# EAGLE design PhotonThingyStick (EAGLE 7.4.0)
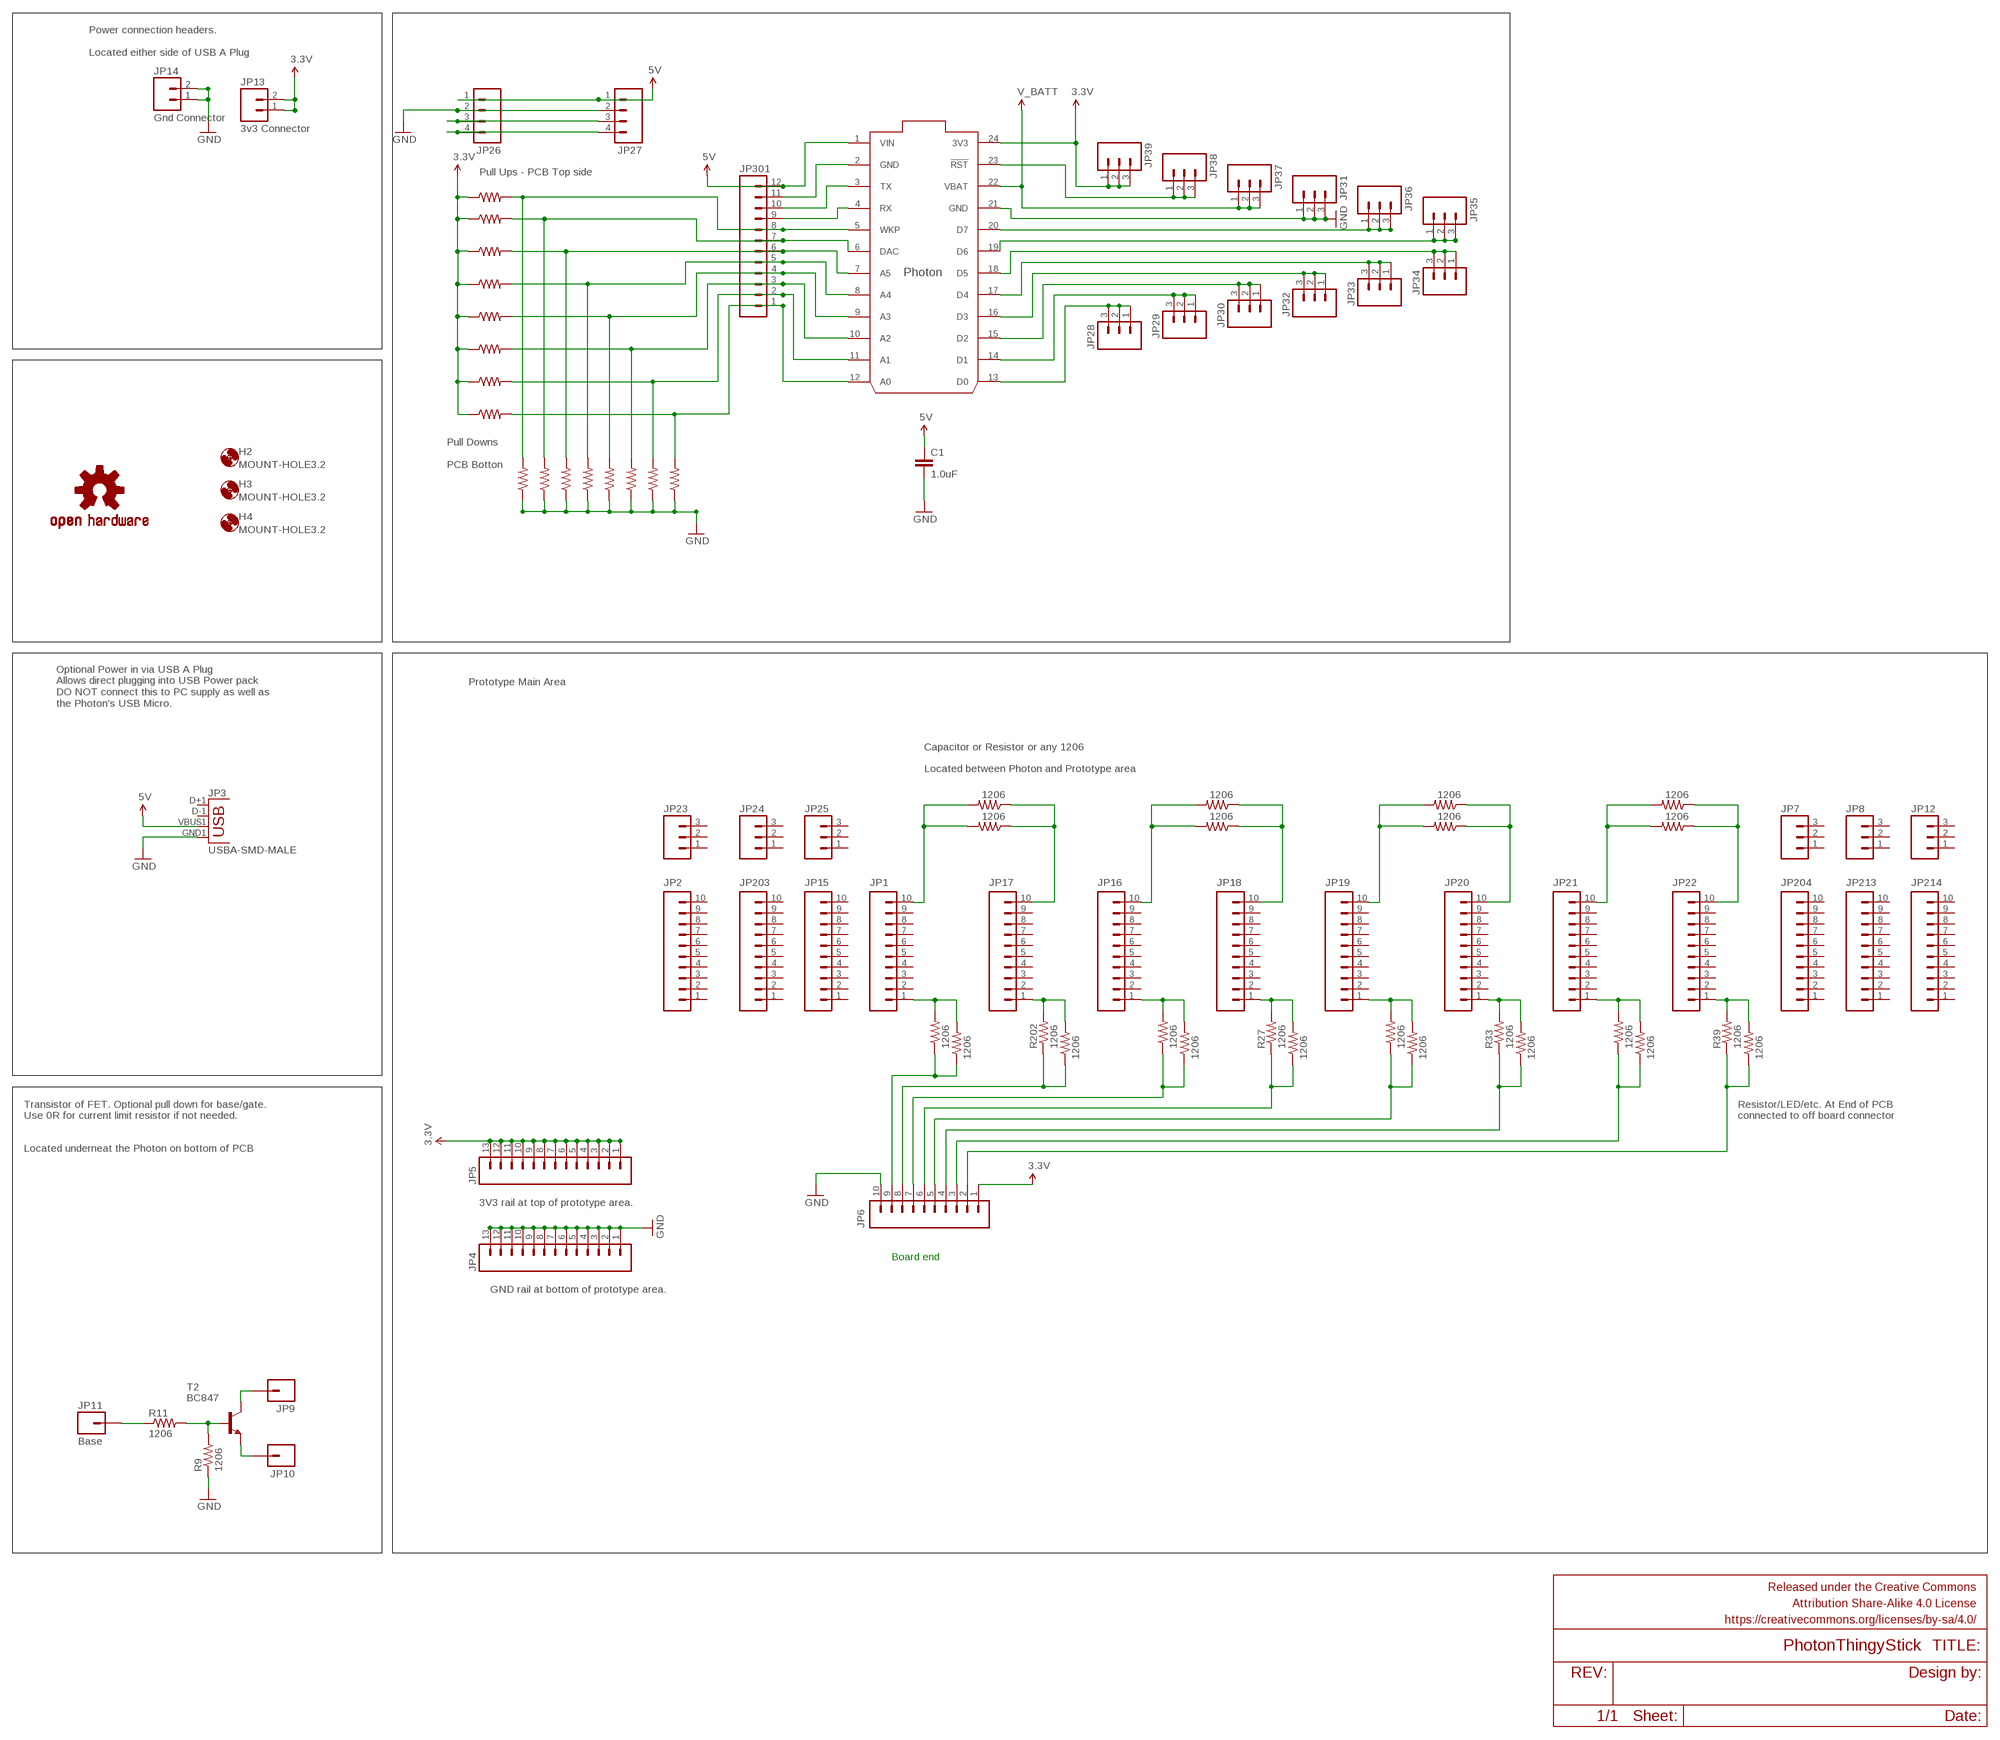
[diagram p0: schematic, sheet 1]

## Parts
C1  1.0uF  1.0UF-25V-+80/-20(0805)"  [0805-CAP]
FRAME1  FRAME-LEDGER  [CREATIVE_COMMONS]
H2  MOUNT-HOLE3.2  [3,2]
H3  MOUNT-HOLE3.2  [3,2]
H4  MOUNT-HOLE3.2  [3,2]
IC1  PHOTON_WITH_HEADERS  [PHOTON]
JP1  M10NO_SILK_PTH_FEMALE  [1X10_NO_SILK]
JP2  M10NO_SILK_PTH_FEMALE  [1X10_NO_SILK]
JP3  USBA-SMD-MALE  [USB-A-SMT-MALE]
JP4  M13  [1X13]
JP5  M13  [1X13]
JP6  M10NO_SILK_PTH_FEMALE  [1X10_NO_SILK]
JP7  M031X03_NO_SILK  [1X03_NO_SILK]
JP8  M031X03_NO_SILK  [1X03_NO_SILK]
JP9  M01PTH  [1X01]
JP10  M01PTH  [1X01]
JP11  Base  M01PTH  [1X01]
JP12  M031X03_NO_SILK  [1X03_NO_SILK]
JP13  3v3 Connector  M02PTH  [1X02]
JP14  Gnd Connector  M02PTH  [1X02]
JP15  M10NO_SILK_PTH_FEMALE  [1X10_NO_SILK]
JP16  M10NO_SILK_PTH_FEMALE  [1X10_NO_SILK]
JP17  M10NO_SILK_PTH_FEMALE  [1X10_NO_SILK]
JP18  M10NO_SILK_PTH_FEMALE  [1X10_NO_SILK]
JP19  M10NO_SILK_PTH_FEMALE  [1X10_NO_SILK]
JP20  M10NO_SILK_PTH_FEMALE  [1X10_NO_SILK]
JP21  M10NO_SILK_PTH_FEMALE  [1X10_NO_SILK]
JP22  M10NO_SILK_PTH_FEMALE  [1X10_NO_SILK]
JP23  M031X03_NO_SILK  [1X03_NO_SILK]
JP24  M031X03_NO_SILK  [1X03_NO_SILK]
JP25  M031X03_NO_SILK  [1X03_NO_SILK]
JP26  M041X04_NO_SILK  [1X04_NO_SILK]
JP27  M041X04_NO_SILK  [1X04_NO_SILK]
JP28  M03PTH  [1X03]
JP29  M03PTH  [1X03]
JP30  M03PTH  [1X03]
JP31  M03PTH  [1X03]
JP32  M03PTH  [1X03]
JP33  M03PTH  [1X03]
JP34  M03PTH  [1X03]
JP35  M03PTH  [1X03]
JP36  M03PTH  [1X03]
JP37  M03PTH  [1X03]
JP38  M03PTH  [1X03]
JP39  M03PTH  [1X03]
JP203  M10NO_SILK_PTH_FEMALE  [1X10_NO_SILK]
JP204  M10NO_SILK_PTH_FEMALE  [1X10_NO_SILK]
JP213  M10NO_SILK_PTH_FEMALE  [1X10_NO_SILK]
JP214  M10NO_SILK_PTH_FEMALE  [1X10_NO_SILK]
JP301  M12PTH  [1X12]
LOGO1  OSHW-LOGOM  [OSHW-LOGO-M]
R1  1206  RESISTOR1206  [1206]
R2  1206  RESISTOR1206  [1206]
R3  1206  RESISTOR1206  [1206]
R4  1206  RESISTOR1206  [1206]
R5  1206  RESISTOR1206  [1206]
R6  1206  RESISTOR1206  [1206]
R7  1206  RESISTOR1206  [1206]
R8  1206  RESISTOR1206  [1206]
R9  1206  RESISTOR1206  [1206]
R10  1206  RESISTOR1206  [1206]
R11  1206  RESISTOR1206  [1206]
R12  1206  RESISTOR1206  [1206]
R13  1206  RESISTOR1206  [1206]
R14  1206  RESISTOR1206  [1206]
R19  1206  RESISTOR1206  [1206]
R20  1206  RESISTOR1206  [1206]
R21  1206  RESISTOR1206  [1206]
R22  1206  RESISTOR1206  [1206]
R23  1206  RESISTOR1206  [1206]
R24  1206  RESISTOR1206  [1206]
R25  1206  RESISTOR1206  [1206]
R26  1206  RESISTOR1206  [1206]
R27  1206  RESISTOR1206  [1206]
R28  1206  RESISTOR1206  [1206]
R29  1206  RESISTOR1206  [1206]
R30  1206  RESISTOR1206  [1206]
R31  1206  RESISTOR1206  [1206]
R32  1206  RESISTOR1206  [1206]
R33  1206  RESISTOR1206  [1206]
R34  1206  RESISTOR1206  [1206]
R35  1206  RESISTOR1206  [1206]
R36  1206  RESISTOR1206  [1206]
R37  1206  RESISTOR1206  [1206]
R38  1206  RESISTOR1206  [1206]
R39  1206  RESISTOR1206  [1206]
R40  1206  RESISTOR1206  [1206]
R41  1206  RESISTOR1206  [1206]
R42  1206  RESISTOR1206  [1206]
R43  1206  RESISTOR1206  [1206]
R44  1206  RESISTOR1206  [1206]
R201  1206  RESISTOR1206  [1206]
R202  1206  RESISTOR1206  [1206]
T2  BC847  [SOT23]

## Nets
3.3V: IC1.24(3V3) JP5.1 JP5.2 JP5.3 JP5.4 JP5.5 JP5.6 JP5.7 JP5.8 JP5.9 JP5.10 JP5.11 JP5.12 JP5.13 JP6.1 JP13.1 JP13.2 JP39.1 JP39.2 JP39.3 R1.1 R2.1 R3.1 R4.1 R5.1 R6.1 R7.1 R12.1
5V: C1.1 IC1.1(VIN) JP3.VBUS1(VBUS) JP26.1 JP27.1 JP301.12
GND: C1.2 IC1.2(GND) IC1.21(GND) JP3.GND1(GND) JP4.1 JP4.2 JP4.3 JP4.4 JP4.5 JP4.6 JP4.7 JP4.8 JP4.9 JP4.10 JP4.11 JP4.12 JP4.13 JP6.10 JP14.1 JP14.2 JP26.2 JP27.2 JP31.1 JP31.2 JP31.3 JP301.11 R8.1 R9.1 R10.1 R13.1 R14.1 R19.1 R20.1 R21.1 R22.1
N$2: JP17.1 R26.2 R202.2
N$3: JP1.1 R23.2 R201.2
N$6: IC1.5(WKP) JP301.8 R8.2 R12.2
N$7: IC1.6(DAC) JP301.7 R5.2 R10.2
N$8: IC1.7(A5) JP301.6 R1.2 R13.2
N$9: IC1.8(A4) JP301.5 R2.2 R14.2
N$10: IC1.9(A3) JP301.4 R3.2 R19.2
N$11: IC1.10(A2) JP301.3 R4.2 R20.2
N$12: IC1.11(A1) JP301.2 R6.2 R21.2
N$13: IC1.12(A0) JP301.1 R7.2 R22.2
N$14: JP6.9 R23.1 R201.1
N$16: IC1.18(D5) JP34.1 JP34.2 JP34.3
N$17: IC1.17(D4) JP33.1 JP33.2 JP33.3
N$18: IC1.16(D3) JP32.1 JP32.2 JP32.3
N$19: IC1.15(D2) JP30.1 JP30.2 JP30.3
N$20: IC1.14(D1) JP29.1 JP29.2 JP29.3
N$21: IC1.13(D0) JP28.1 JP28.2 JP28.3
N$23: JP1.10 R24.2 R25.2
N$24: IC1.23(!RST) JP38.1 JP38.2 JP38.3
N$26: JP17.10 R24.1 R25.1
N$28: JP6.8 R26.1 R202.1
N$29: JP18.1 R27.2 R32.2
N$30: JP16.1 R28.2 R29.2
N$31: JP6.7 R28.1 R29.1
N$33: JP16.10 R30.2 R31.2
N$34: JP18.10 R30.1 R31.1
N$36: JP6.6 R27.1 R32.1
N$37: JP20.1 R33.2 R38.2
N$38: IC1.20(D7) JP36.1 JP36.2 JP36.3
N$39: IC1.19(D6) JP35.1 JP35.2 JP35.3
N$40: JP19.1 R34.2 R35.2
N$43: JP6.5 R34.1 R35.1
N$53: JP19.10 R36.2 R37.2
N$54: JP20.10 R36.1 R37.1
N$57: JP6.4 R33.1 R38.1
N$58: JP22.1 R39.2 R44.2
N$59: JP11.1 R11.1
N$60: R9.2 R11.2 T2.1(B)
N$61: JP9.1 T2.3(C)
N$62: JP10.1 T2.2(E)
N$63: JP21.1 R40.2 R41.2
N$64: JP6.3 R40.1 R41.1
N$68: JP21.10 R42.2 R43.2
N$69: JP22.10 R42.1 R43.1
N$72: JP6.2 R39.1 R44.1
RX: IC1.4(RX) JP26.4 JP27.4 JP301.9
TX: IC1.3(TX) JP26.3 JP27.3 JP301.10
V_BATT: IC1.22(VBAT) JP37.1 JP37.2 JP37.3
Unconnected: JP1.2 JP1.3 JP1.4 JP1.5 JP1.6 JP1.7 JP1.8 JP1.9 JP2.1 JP2.2 JP2.3 JP2.4 JP2.5 JP2.6 JP2.7 JP2.8 JP2.9 JP2.10 JP3.D+1(D+) JP3.D-1(D-) JP7.1 JP7.2 JP7.3 JP8.1 JP8.2 JP8.3 JP12.1 JP12.2 JP12.3 JP15.1 JP15.2 JP15.3 JP15.4 JP15.5 JP15.6 JP15.7 JP15.8 JP15.9 JP15.10 JP16.2 JP16.3 JP16.4 JP16.5 JP16.6 JP16.7 JP16.8 JP16.9 JP17.2 JP17.3 JP17.4 JP17.5 JP17.6 JP17.7 JP17.8 JP17.9 JP18.2 JP18.3 JP18.4 JP18.5 JP18.6 JP18.7 JP18.8 JP18.9 JP19.2 JP19.3 JP19.4 JP19.5 JP19.6 JP19.7 JP19.8 JP19.9 JP20.2 JP20.3 JP20.4 JP20.5 JP20.6 JP20.7 JP20.8 JP20.9 JP21.2 JP21.3 JP21.4 JP21.5 JP21.6 JP21.7 JP21.8 JP21.9 JP22.2 JP22.3 JP22.4 JP22.5 JP22.6 JP22.7 JP22.8 JP22.9 JP23.1 JP23.2 JP23.3 JP24.1 JP24.2 JP24.3 JP25.1 JP25.2 JP25.3 JP203.1 JP203.2 JP203.3 JP203.4 JP203.5 JP203.6 JP203.7 JP203.8 JP203.9 JP203.10 JP204.1 JP204.2 JP204.3 JP204.4 JP204.5 JP204.6 JP204.7 JP204.8 JP204.9 JP204.10 JP213.1 JP213.2 JP213.3 JP213.4 JP213.5 JP213.6 JP213.7 JP213.8 JP213.9 JP213.10 JP214.1 JP214.2 JP214.3 JP214.4 JP214.5 JP214.6 JP214.7 JP214.8 JP214.9 JP214.10

## Notes on the sheet
- Power connection headers.
  
  Located either side of USB A Plug
- Pull Ups - PCB Top side
- Pull Downs
  
  PCB Botton
- Prototype Main Area
- Optional Power in via USB A Plug
  Allows direct plugging into USB Power pack
  DO NOT connect this to PC supply as well as
  the Photon's USB Micro.
- Capacitor or Resistor or any 1206
- Located between Photon and Prototype area
- Transistor of FET. Optional pull down for base/gate.
  Use 0R for current limit resistor if not needed.
- Resistor/LED/etc. At End of PCB 
  connected to off board connector
- Located underneat the Photon on bottom of PCB
- 3V3 rail at top of prototype area.
- Board end
- GND rail at bottom of prototype area.

## Library data of the parts
C1 = SparkFun-Capacitors:1.0UF-25V-+80/-20(0805): CAP-11625; PROD_ID: CAP-11625
FRAME1 = SparkFun-Aesthetics:FRAME-LEDGER: Schematic Frame Standard 11x14 US Ledger frame
H2-H4 = holes:MOUNT-HOLE: MOUNTING HOLE with drill center marker
IC1 = Spark:PHOTON
JP1 JP2 JP6 JP15-JP22 JP203 JP204 JP213 JP214 = SparkFun-Connectors:M10: Header 10 Standard 10-pin 0.1" header. Use with straight break away headers (SKU : PRT-00116), right angle break away headers (PRT-00553), swiss pins (PRT-00743), machine pins (PRT-00117), and female headers (PRT-00115).; PROD_ID: CONN-11563
JP3 = SparkFun-Connectors:USB: USB Connectors USB-B-PTH is fully proven SKU : PRT-00139/CONN-08278 USB-miniB is fully proven SKU : PRT-00587 USB-A-PCB is untested. USB-A-H is throughly reviewed, but untested. Spark Fun Electronics SKU : PRT-00437 USB-B-SMT is throughly reviewed, but untested. Needs silkscreen touching up. USB-A-S has not been used/tested USB-MB-H has not been used/tested USB-MICROB has been used. CONN-09505
JP4 JP5 = SparkFun-Connectors:M13: 13-pin single row .1" header
JP7 JP8 JP12 JP23-JP25 JP28-JP39 = SparkFun-Connectors:M03: Header 3 Standard 3-pin 0.1" header. Use with straight break away headers (SKU : PRT-00116), right angle break away headers (PRT-00553), swiss pins (PRT-00743), machine pins (PRT-00117), and female headers (PRT-00115). Molex polarized connector foot print use with SKU : PRT-08232 with associated crimp pins and housings.
JP9-JP11 = SparkFun-Connectors:M01: Header 1 Standard 1-pin 0.1" header. Use with straight break away headers (SKU : PRT-00116), right angle break away headers (PRT-00553), swiss pins (PRT-00743), machine pins (PRT-00117), and female headers (PRT-00115).
JP13 JP14 = SparkFun-Connectors:M02: Standard 2-pin 0.1" header. Use with - straight break away headers ( PRT-00116) - right angle break away headers (PRT-00553) - swiss pins (PRT-00743) - machine pins (PRT-00117) - female headers (PRT-00115) Molex polarized connector foot print use with: PRT-08233 with associated crimp pins and housings. 2.54_SCREWTERM for use with PRT-10571. 3.5mm Screw Terminal footprints for PRT-08084 5mm Screw Terminal footprints for use with PRT-08432
JP26 JP27 = SparkFun-Connectors:M04: Header 4 Standard 4-pin 0.1" header. Use with straight break away headers (SKU : PRT-00116), right angle break away headers (PRT-00553), swiss pins (PRT-00743), machine pins (PRT-00117), and female headers (PRT-00115). Molex polarized connector foot print use with SKU : PRT-08231 with associated crimp pins and housings. 1MM SMD Version SKU: PRT-10208
JP301 = SparkFun-Connectors:M12: Header 12 Standard 12-pin 0.1" header. Use with straight break away headers (SKU : PRT-00116), right angle break away headers (PRT-00553), swiss pins (PRT-00743), machine pins (PRT-00117), and female headers (PRT-00115).
LOGO1 = SparkFun-Aesthetics:OSHW-LOGO: Open Source Hardware Logo This logo indicates the piece of hardware it is found on incorporates a OSHW license and/or adheres to the definition of open source hardware found here: http://freedomdefined.org/OSHW
R1-R8 R10 R12-R14 R19-R44 R201 R202 = SparkFun-Resistors:RESISTOR: Resistor Basic schematic elements and footprints for 0603, 1206, and PTH resistors.
R9 R11 = SparkFun-Passives:RESISTOR: Resistor Basic schematic elements and footprints for 0603, 1206, and PTH resistors.
T2 = transistor-neu-to92:BC847: NPN TRANSISTOR

## Board
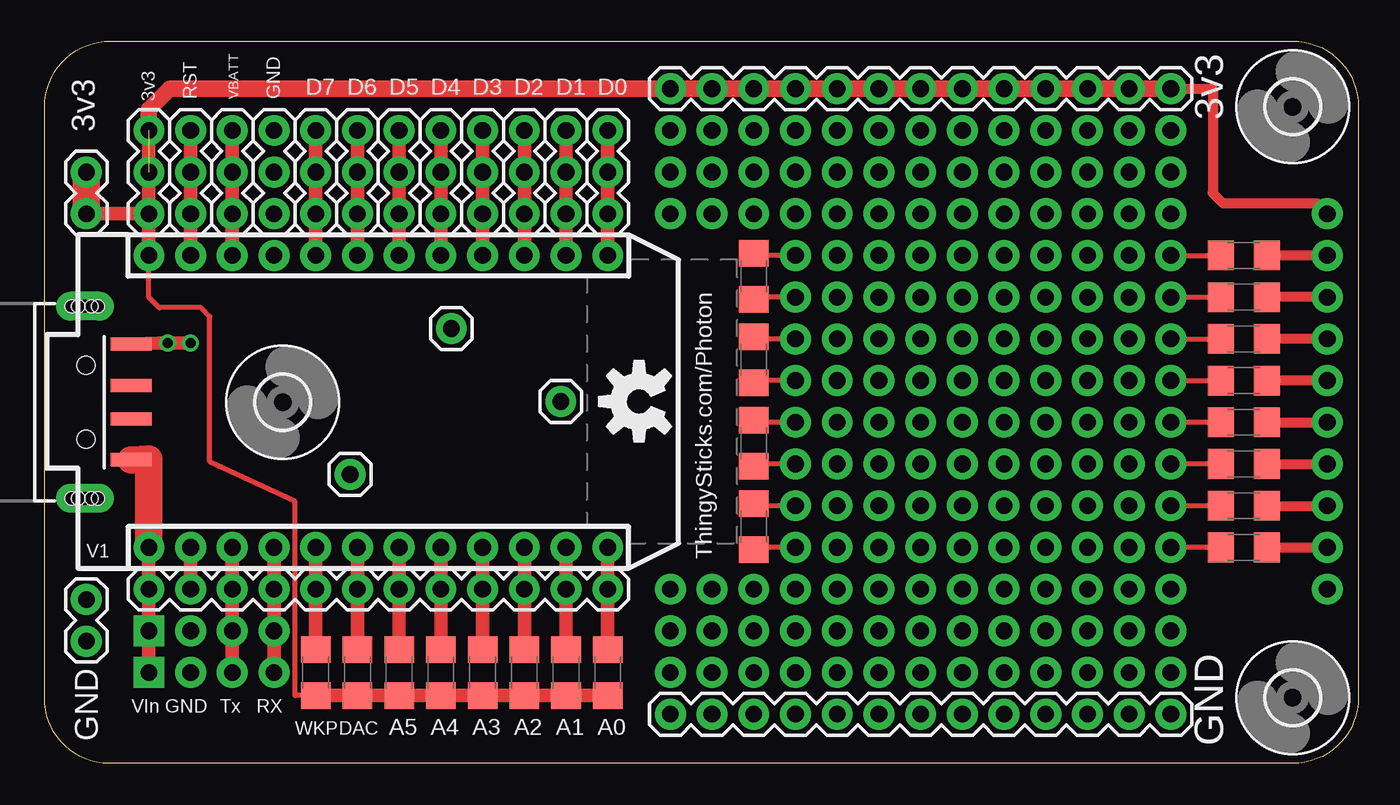
[diagram p1: board, top side]
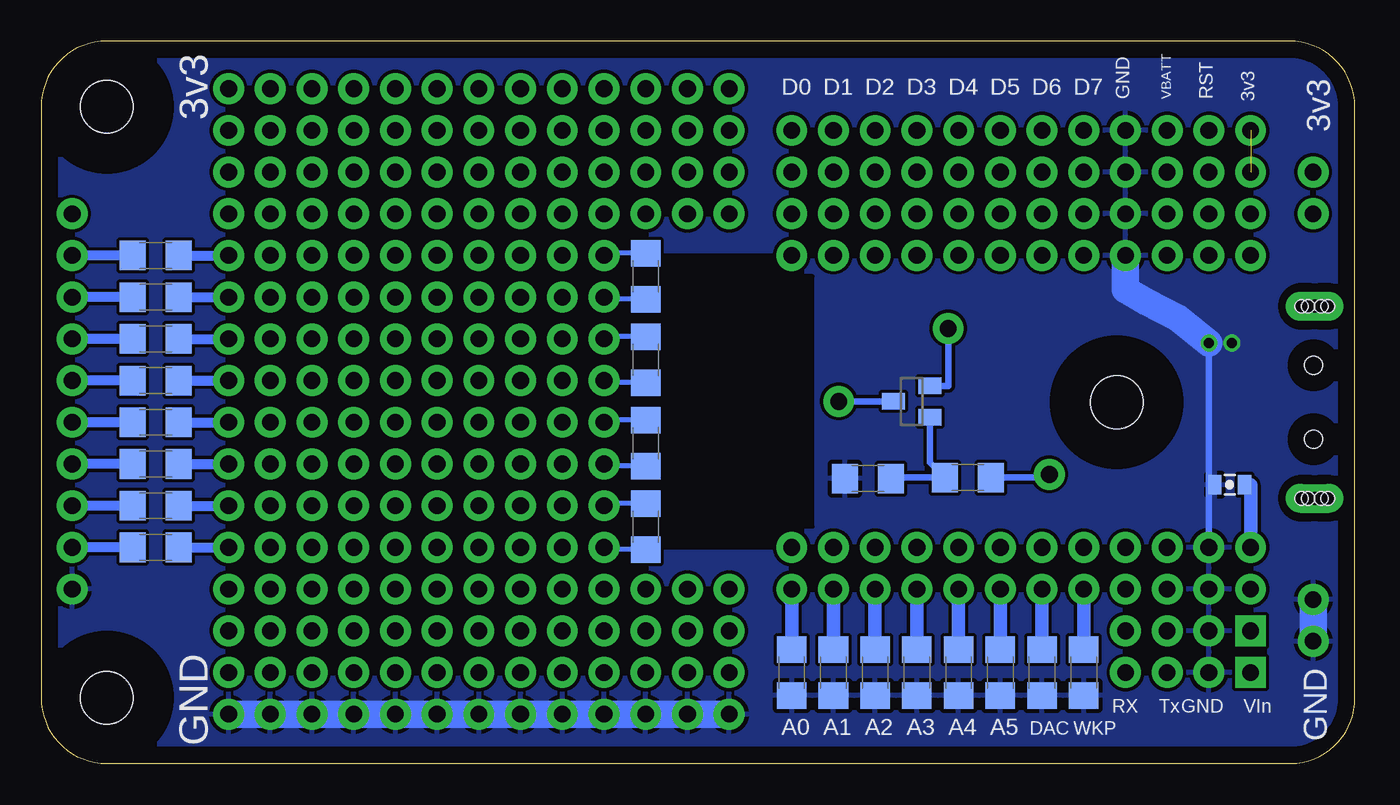
[diagram p2: board, bottom side, seen from below]

Size 80 x 44 mm. Coordinates in mm from the lower left corner, seen from the top.
Outline: 0,4 arc90 3.9,0 76,0 arc90 80,4 80,40 arc90 76,44 4,44 arc90 0,40 0,3.72
Copper layers (1*16): Top 0.035mm / dielectric 1.5mm / Bottom 0.035mm
Design rules "default": minimum track width 10mil, minimum drill 24mil, track to track 8mil, track to pad 8mil, pad to pad 8mil, via to via 8mil, smd to smd 8mil, copper to edge 40mil, drill to drill 8mil, minimum pad ring 10mil, minimum via ring 8mil, stop-mask expansion 4mil, vias tented up to drill 0mil, thermal gap 10mil
tRestrict: area 33,13.2 to 41.9,30.9
bRestrict: area 33,13.2 to 41.9,30.9

### Footprints (pad centres in the part's own frame; a part is rotated, then mirrored left to right if it is on the bottom)
0805-CAP = smd 0.8 x 1.2: 1 -0.9,0; 2 0.9,0
3,2 = hole 3.2: 0,0
PHOTON = drill 1.016 pad 1.88: 1 1.27,32.258; 2 1.27,29.718; 3 1.27,27.178; 4 1.27,24.638; 5 1.27,22.098; 6 1.27,19.558; 7 1.27,17.018; 8 1.27,14.478; 9 1.27,11.938; 10 1.27,9.398; 11 1.27,6.858; 12 1.27,4.318; 13 19.05,4.318; 14 19.05,6.858; 15 19.05,9.398; 16 19.05,11.938; 17 19.05,14.478; 18 19.05,17.018; 19 19.05,19.558; 20 19.05,22.098; 21 19.05,24.638; 22 19.05,27.178; 23 19.05,29.718; 24 19.05,32.258
1X10_NO_SILK = drill 1.016 pad 1.88: 1 0,0; 2 2.54,0; 3 5.08,0; 4 7.62,0; 5 10.16,0; 6 12.7,0; 7 15.24,0; 8 17.78,0; 9 20.32,0; 10 22.86,0
USB-A-SMT-MALE = smd 0.8 x 2.5: D+1 1.027,-5.87; D-1 -1.027,-5.87; GND1 3.551,-5.87; VBUS1 -3.5,-5.87 | drill 0.8 pad 1.778 long: P$1 5.85,-3.05; P$3 -5.85,-3.05 | hole 1.1: 2.25,-3.12; -2.25,-3.12 | hole 0.8: -5.85,-3.45; -5.85,-3.85; -5.85,-2.65; -5.85,-2.25; 5.85,-3.45; 5.85,-3.85; 5.85,-2.65; 5.85,-2.25
1X13 = drill 1.016 pad 1.88: 1 0,0; 2 2.54,0; 3 5.08,0; 4 7.62,0; 5 10.16,0; 6 12.7,0; 7 15.24,0; 8 17.78,0; 9 20.32,0; 10 22.86,0; 11 25.4,0; 12 27.94,0; 13 30.48,0
1X03_NO_SILK = drill 1.016 pad 1.88: 1 0,0; 2 2.54,0; 3 5.08,0
1X01 = drill 1.016 pad 1.88: 1 0,0
1X02 = drill 1.016 pad 1.88: 1 0,0; 2 2.54,0
1X04_NO_SILK = drill 1.016 pad 1.88 square: 1 0,0 | drill 1.016 pad 1.88: 2 2.54,0; 3 5.08,0; 4 7.62,0
1X03 = drill 1.016 pad 1.88: 1 0,0; 2 2.54,0; 3 5.08,0
1X12 = drill 1.016 pad 1.88: 1 0,0; 2 2.54,0; 3 5.08,0; 4 7.62,0; 5 10.16,0; 6 12.7,0; 7 15.24,0; 8 17.78,0; 9 20.32,0; 10 22.86,0; 11 25.4,0; 12 27.94,0
1206 = smd 1.6 x 1.8: 1 -1.4,0; 2 1.4,0
SOT23 = smd 1 x 1.4: 1 -0.95,-1.1; 2 0.95,-1.1; 3 0,1.1

### Placement (x,y rotation side)
C1  7.62,16.97 180 bottom
FRAME1  6.85,-14.54 0 top  (outside the outline)
H2  14.5,22 0 top
H3  76,40 0 top
H4  76,4 0 top
IC1  38.61,11.89 90 top
JP1  68.58,13.16 180 top
JP2  68.58,38.56 180 top
JP3  -0.6,22 90 top
JP4  68.58,3 180 top
JP5  68.58,41.1 180 top
JP6  78.11,33.48 270 top
JP7  38.1,38.56 0 top
JP8  38.1,36.02 0 top
JP9  31.43,22.05 0 top
JP10  24.77,26.5 0 top
JP11  18.61,17.61 0 top
JP12  38.1,33.48 0 top
JP13  2.54,33.48 90 top
JP14  2.54,9.98 270 top
JP15  68.58,5.54 180 top
JP16  68.58,18.24 180 top
JP17  68.58,15.7 180 top
JP18  68.58,20.78 180 top
JP19  68.58,23.32 180 top
JP20  68.58,25.86 180 top
JP21  68.58,28.4 180 top
JP22  68.58,30.94 180 top
JP23  38.1,10.62 0 top
JP24  38.1,8.08 0 top
JP25  38.1,5.54 0 top
JP26  6.35,5.54 0 top
JP27  6.35,8.08 0 top
JP28  34.29,33.48 90 top
JP29  31.75,33.48 90 top
JP30  29.21,38.56 270 top
JP31  13.97,33.48 90 top
JP32  26.67,38.56 270 top
JP33  24.13,38.56 270 top
JP34  21.59,38.56 270 top
JP35  19.05,38.56 270 top
JP36  16.51,38.56 270 top
JP37  11.43,33.48 90 top
JP38  8.89,33.48 90 top
JP39  6.35,33.48 90 top
JP203  68.58,36.02 180 top
JP204  68.58,33.48 180 top
JP213  68.58,10.62 180 top
JP214  68.58,8.08 180 top
JP301  34.29,10.62 180 top
LOGO1  36.2,22.05 90 top
R1  21.59,5.54 90 top
R2  24.13,5.54 90 top
R3  26.67,5.54 90 top
R4  29.21,5.54 90 top
R5  19.05,5.54 90 top
R6  31.75,5.54 90 top
R7  34.29,5.54 90 top
R8  16.51,5.54 90 bottom
R9  29.65,17.35 0 bottom
R10  19.05,5.54 90 bottom
R11  23.56,17.41 180 bottom
R12  16.51,5.54 90 top
R13  21.59,5.54 90 bottom
R14  24.13,5.54 90 bottom
R19  26.67,5.54 90 bottom
R20  29.21,5.54 90 bottom
R21  31.75,5.54 90 bottom
R22  34.29,5.54 90 bottom
R23  73.03,13.16 0 bottom
R24  43.18,14.43 270 top
R25  43.18,14.43 270 bottom
R26  73.03,15.7 0 bottom
R27  73.03,20.78 180 top
R28  73.03,18.24 180 top
R29  73.03,18.24 0 bottom
R30  43.18,19.51 270 top
R31  43.18,19.51 270 bottom
R32  73.03,20.78 0 bottom
R33  73.03,25.86 180 top
R34  73.03,23.32 180 top
R35  73.03,23.32 0 bottom
R36  43.18,24.59 270 top
R37  43.18,24.59 270 bottom
R38  73.03,25.86 0 bottom
R39  73.03,30.94 180 top
R40  73.03,28.4 180 top
R41  73.03,28.4 0 bottom
R42  43.18,29.67 270 top
R43  43.18,29.67 270 bottom
R44  73.03,30.94 0 bottom
R201  73.03,13.16 180 top
R202  73.03,15.7 180 top
T2  26.99,22.05 90 bottom

### Tracks (layer width: path | path; a pad name or v marks a point on that pad's centre or on a via)
3.3V  (1 unrouted)
  Top 0.305: R12.1 15.24,4.14 15.24,15.95 10.06,18.37 10.06,27.23 9.53,27.77 6.99,27.77 6.35,28.4 IC1.24
  Top 0.61: JP5.1 71.12,41.1 71.12,34.75 71.75,34.11 77.47,34.11 JP6.1
  Top 0.813: R7.1 R6.1 R4.1 R3.1 R2.1 R1.1 R5.1 R12.1 | IC1.24 JP39.1 | JP39.1 JP39.3 | JP39.1 JP13.1
  Top 1.016: JP5.1 JP5.2 JP5.3 JP5.4 JP5.5 JP5.6 JP5.7 JP5.8 JP5.9 JP5.10 JP5.11 JP5.12 JP5.13 7.62,41.1 6.35,39.83 JP39.3
  Top 1.676: JP13.2 JP13.1
5V
  Top 0.813: IC1.1 JP301.12 JP27.1 JP26.1
  Top 1.016: IC1.1 6.35,15.7
  Top 1.676: JP3.VBUS1 6.35,18.55 IC1.1
  Bottom 0.813: C1.1 6.35,16.97 IC1.1
GND  (via drill 0.6)
  Top 0.813: JP3.GND1 6.99,25.6 v7.49,25.61 v8.89,25.61 | IC1.2 JP301.11
  Top 1.016: 13.97,30.81 arc-90 IC1.21
  Bottom 0.406: IC1.2 v8.89,25.61 | C1.2 8.89,16.97
  Bottom 0.813: 13.97,30.81 IC1.21
  Bottom 1.676: JP4.1 JP4.2 JP4.3 JP4.4 JP4.5 JP4.6 JP4.7 JP4.8 JP4.9 JP4.10 JP4.11 JP4.12 JP4.13 | 13.97,30.81 13.97,28.86 12.73,28.13 10.79,27.13 v8.89,25.61 | JP14.1 JP14.2
  pour Bottom: -2.54,-0.17 81.28,-0.17 80.64,44.91 -2.54,44.91
N$2
  Top 0.305: R26.2 JP17.1
  Bottom 0.61: R26.2 JP17.1
N$3
  Top 0.305: R23.2 JP1.1
  Bottom 0.61: R23.2 JP1.1
N$6
  Top 0.813: R8.2 JP301.8 IC1.5
  Bottom 0.813: R8.2 JP301.8
N$7
  Top 0.813: IC1.6 JP301.7 R10.2
  Bottom 0.813: R10.2 JP301.7
N$8
  Top 0.813: R13.2 JP301.6 IC1.7
  Bottom 0.813: R13.2 JP301.6
N$9
  Top 0.813: R14.2 JP301.5 IC1.8
  Bottom 0.813: 24.26,9.98 JP301.5 R14.2
N$10
  Top 0.813: R19.2 JP301.4 IC1.9
  Bottom 0.813: R19.2 JP301.4
N$11
  Top 0.813: R20.2 JP301.3 IC1.10
  Bottom 0.813: 29.34,9.98 JP301.3 R20.2
N$12
  Top 0.813: R21.2 JP301.2 IC1.11
  Bottom 0.813: R21.2 JP301.2
N$13
  Top 0.813: R22.2 JP301.1 IC1.12
  Bottom 0.813: 34.42,9.98 JP301.1 R22.2
N$14
  Top 0.61: R23.1 JP6.9
  Bottom 0.61: R23.1 JP6.9
N$16
  Top 0.813: JP34.1 JP34.2 JP34.3 IC1.18
N$17
  Top 0.813: IC1.17 JP33.3 JP33.2 JP33.1
N$18
  Top 0.813: JP32.1 JP32.2 JP32.3 IC1.16
N$19
  Top 0.813: IC1.15 JP30.3 JP30.2 JP30.1
N$20
  Top 0.813: IC1.14 JP29.1 JP29.2 JP29.3
N$21
  Top 0.813: IC1.13 JP28.1 JP28.2 JP28.3
N$23
  Top 0.305: JP1.10 43.31,13.16 R25.2
  Bottom 0.305: R25.2 45.72,13.03 JP1.10
N$24
  Top 0.813: JP38.3 JP38.2 JP38.1 IC1.23
N$26
  Top 0.305: JP17.10 43.31,15.7 R25.1
  Bottom 0.305: R25.1 45.72,15.83 JP17.10
N$28
  Top 0.61: R26.1 JP6.8
  Bottom 0.61: R26.1 JP6.8
N$29
  Top 0.305: R32.2 JP18.1
  Bottom 0.61: R32.2 JP18.1
N$30
  Top 0.305: R29.2 JP16.1
  Bottom 0.61: R29.2 JP16.1
N$31
  Top 0.61: R29.1 JP6.7
  Bottom 0.61: R29.1 JP6.7
N$33
  Top 0.305: JP16.10 43.31,18.24 R31.2
  Bottom 0.305: R31.2 45.72,18.11 JP16.10
N$34
  Top 0.305: JP18.10 43.31,20.78 R31.1
  Bottom 0.305: R31.1 45.72,20.91 JP18.10
N$36
  Top 0.61: R32.1 JP6.6
  Bottom 0.61: R32.1 JP6.6
N$37
  Top 0.305: JP20.1 R38.2
  Bottom 0.61: R38.2 JP20.1
N$38
  Top 0.813: JP36.1 JP36.2 JP36.3 IC1.20
N$39
  Top 0.813: IC1.19 JP35.3 JP35.2 JP35.1
N$40
  Top 0.305: JP19.1 R35.2
  Bottom 0.61: R35.2 JP19.1
N$43
  Top 0.61: JP6.5 R35.1
  Bottom 0.61: R35.1 JP6.5
N$53
  Top 0.305: JP19.10 43.31,23.32 R37.2
  Bottom 0.305: R37.2 45.72,23.19 JP19.10
N$54
  Top 0.305: JP20.10 43.31,25.86 R37.1
  Bottom 0.305: R37.1 45.72,25.99 JP20.10
N$57
  Top 0.61: JP6.4 R38.1
  Bottom 0.61: R38.1 JP6.4
N$58
  Top 0.305: JP22.1 R44.2
  Bottom 0.61: R44.2 JP22.1
N$59
  Bottom 0.406: R11.1 18.8,17.41 JP11.1
N$60
  Bottom 0.406: T2.1 25.89,18.34 R11.2 28.19,17.41 R9.2
N$61
  Bottom 0.406: T2.3 JP9.1
N$62
  Bottom 0.406: T2.2 24.77,23 JP10.1
N$63
  Top 0.305: JP21.1 R41.2
  Bottom 0.61: R41.2 JP21.1
N$64
  Top 0.61: JP6.3 R41.1
  Bottom 0.61: R41.1 JP6.3
N$68
  Top 0.305: JP21.10 43.31,28.4 R43.2
  Bottom 0.305: R43.2 45.72,28.27 JP21.10
N$69
  Top 0.305: JP22.10 43.31,30.94 R43.1
  Bottom 0.305: R43.1 45.72,31.07 JP22.10
N$72
  Top 0.61: JP6.2 R44.1
  Bottom 0.61: R44.1 JP6.2
RX
  Top 0.813: IC1.4 JP301.9 JP27.4 JP26.4
TX
  Top 0.813: IC1.3 JP301.10 JP27.3 JP26.3
V_BATT
  Top 0.813: IC1.22 JP37.1 JP37.2 JP37.3

### Text on the board
tNames: VBATT | 3v3 | D7 | D6 | D5 | D4 | D3 | D2 | D1 | D0 | 3v3 | RST | GND | 3v3 | V1 | ThingySticks.com/Photon | GND | VIn | GND | Tx | RX | WKP | DAC | A5 | A4 | A3 | A2 | A1 | A0 | GND | GND
bNames: VBATT | 3v3 | D7 | D6 | D5 | D4 | D3 | D2 | D1 | D0 | 3v3 | RST | GND | 3v3 | GND | VIn | GND | Tx | RX | WKP | DAC | A5 | A4 | A3 | A2 | A1 | A0 | GND